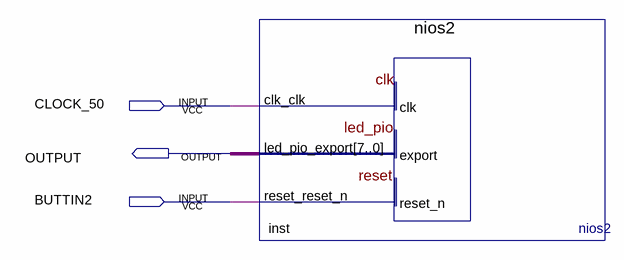
[diagram p0: schematic sheet]
// Quartus schematic Nios2.bdf as structural Verilog: 1 symbols, 3 pins
module Nios2 (
  input  CLOCK_50,
  input  BUTTIN2,
  output OUTPUT
);

  wire [7:0] inst_led_pio_export;

  nios2 inst (.clk_clk(CLOCK_50), .reset_reset_n(BUTTIN2), .led_pio_export(inst_led_pio_export));
endmodule
